# EAGLE design PumpkinHardwareV2 (EAGLE 9.6.2)
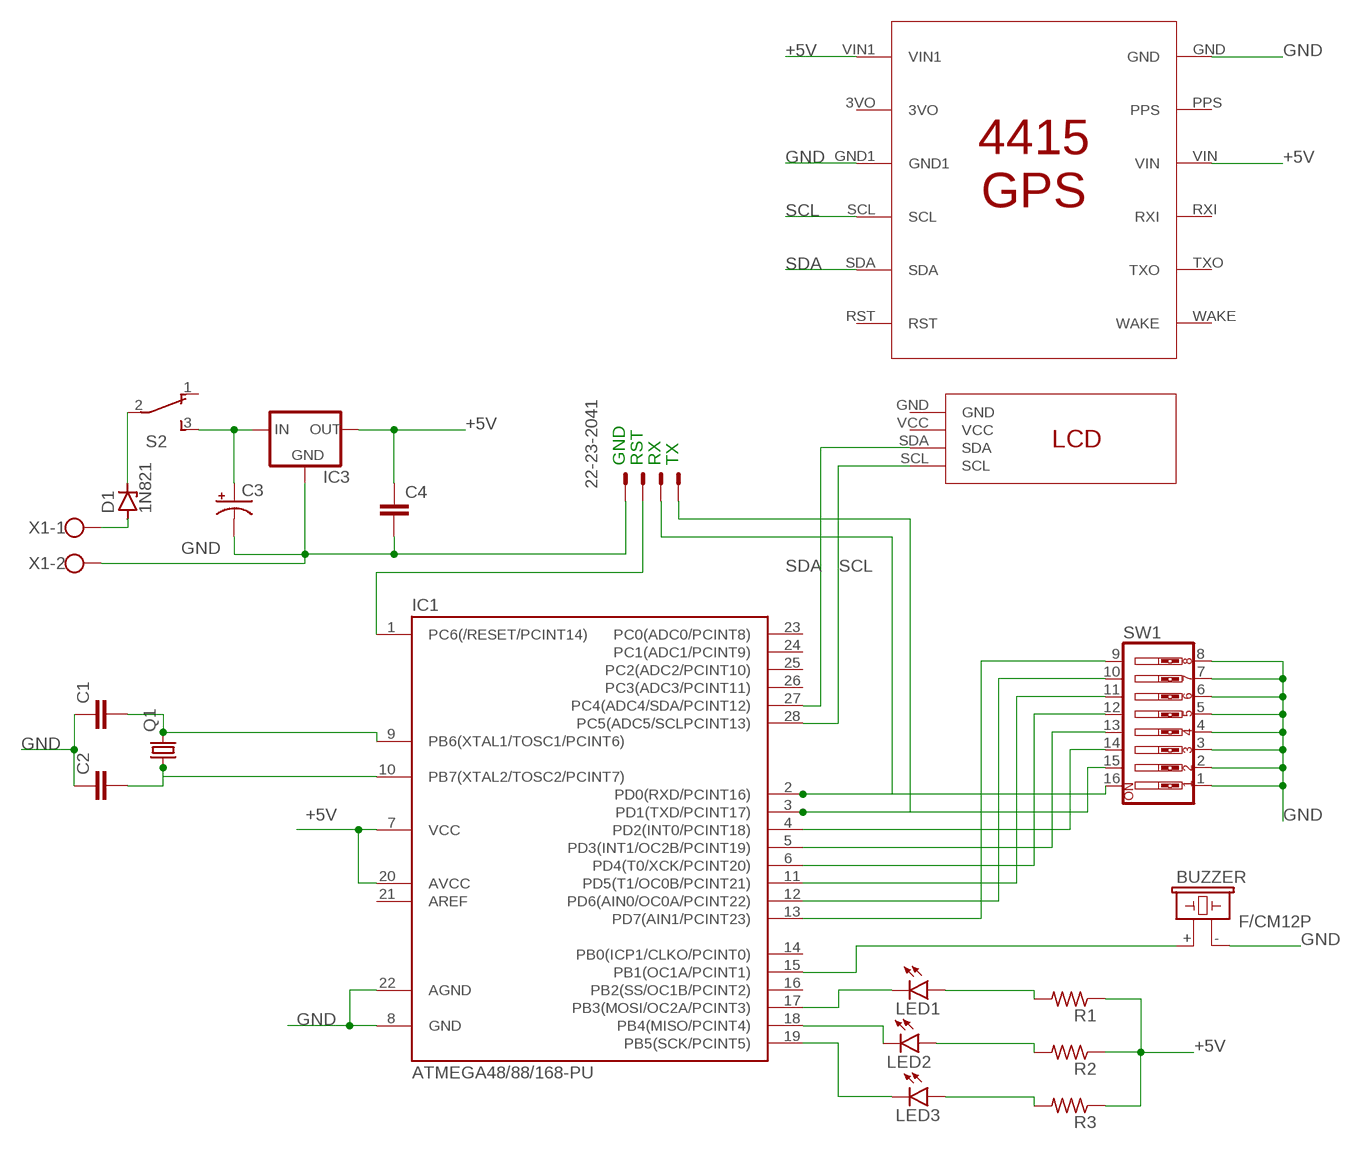
[diagram p0: schematic, sheet 1]

## Parts
BUZZER  F/CM12P  [F/CM12P]
C1  C2.5/2  [C2.5-2]
C2  C2.5/2  [C2.5-2]
C3  CPOL-USE3.5-8  [E3,5-8]
C4  C2.5/2  [C2.5-2]
D1  1N821  [DO35Z10]
GPS  4415  [4415]
IC1  ATMEGA48/88/168-PU  [DIL28-3]
IC3  78XXL  [78XXL]
LED1  TLLG4400  [LED3MM]
LED2  TLLY4400  [LED3MM]
LED3  TLLR4400  [LED3MM]
Q1  CRYSTALHC49S  [HC49/S]
R1  R-US_0207/10  [0207/10]
R2  R-US_0207/10  [0207/10]
R3  R-US_0207/10  [0207/10]
S2  TL36PO  [TL3XPO]
SW1  SW_DIP-8  [EDG-08]
U$1  I2C_LCD  [I2C_LCD]
X1  W237-102  [W237-102]
X2  22-23-2041  [22-23-2041]

## Nets
+5V: C4.1 GPS.VIN GPS.VIN1 IC1.7(VCC) IC1.20(AVCC) IC3.OUT R1.1 R2.1 R3.1
GND: BUZZER.- C1.1 C2.1 C3.- C4.2 GPS.GND GPS.GND1 IC1.8(GND) IC1.22(AGND) IC3.GND SW1.1 SW1.2 SW1.3 SW1.4 SW1.5 SW1.6 SW1.7 SW1.8 X1.2 X2.1
N$1: LED1.A R1.2
N$2: IC1.18(PB4(MISO/PCINT4)) LED2.K(C)
N$3: IC1.19(PB5(SCK/PCINT5)) LED3.K(C)
N$4: LED2.A R2.2
N$5: LED3.A R3.2
N$6: IC1.17(PB3(MOSI/OC2A/PCINT3)) LED1.K(C)
N$7: IC1.13(PD7(AIN1/PCINT23)) SW1.9
N$8: IC1.12(PD6(AIN0/OC0A/PCINT22)) SW1.10
N$9: IC1.11(PD5(T1/OC0B/PCINT21)) SW1.11
N$10: IC1.6(PD4(T0/XCK/PCINT20)) SW1.12
N$11: IC1.5(PD3(INT1/OC2B/PCINT19)) SW1.13
N$12: IC1.4(PD2(INT0/PCINT18)) SW1.14
N$13: IC1.3(PD1(TXD/PCINT17)) SW1.15 X2.4
N$14: D1.C S2.2(P)
N$15: C2.2 IC1.10(PB7(XTAL2/TOSC2/PCINT7)) Q1.1
N$16: C1.2 IC1.9(PB6(XTAL1/TOSC1/PCINT6)) Q1.2
N$17: D1.A X1.1
N$18: C3.+ IC3.IN S2.3(S)
N$19: BUZZER.+ IC1.15(PB1(OC1A/PCINT1))
N$20: IC1.1(PC6(/RESET/PCINT14)) X2.2
N$21: IC1.2(PD0(RXD/PCINT16)) SW1.16 X2.3
SCL: GPS.SCL IC1.28(PC5(ADC5/SCLPCINT13)) U$1.SCL
SDA: GPS.SDA IC1.27(PC4(ADC4/SDA/PCINT12)) U$1.SDA
Unconnected: GPS.3VO GPS.PPS GPS.RST GPS.RXI GPS.TXO GPS.WAKE IC1.14(PB0(ICP1/CLKO/PCINT0)) IC1.16(PB2(SS/OC1B/PCINT2)) IC1.21(AREF) IC1.23(PC0(ADC0/PCINT8)) IC1.24(PC1(ADC1/PCINT9)) IC1.25(PC2(ADC2/PCINT10)) IC1.26(PC3(ADC3/PCINT11)) S2.1(O) U$1.GND U$1.VCC

## Notes on the sheet
- GND | RST | RX | TX

## Library data of the parts
BUZZER = buzzer:F/CM12P: BUZZER Source: Buerklin; OC_FARNELL: unknown; OC_NEWARK: unknown
C1 C2 C4 = capacitor-wima:C: CAPACITOR naming: grid - package width
C3 = rcl:CPOL-US: POLARIZED CAPACITOR, American symbol; SPICEPREFIX: C
D1 = diode:1N821: Reference DIODE temperature compensated, 6,2 V
GPS = pumpkin_computer_lib:4415
IC1 = atmega8:ATMEGA48/88/168-PU
IC3 = v-reg:78XXL: VOLTAGE REGULATOR
LED1 = led:TLLG4400: Low Current (2mA) LED 3 mm Tinted Diffused Package color GREEN Source: Data sheet <http://www.farnell.com/datasheets/391098.pdf>; MF: VISHAY SEMICONDUCTOR; OC_FARNELL: 1612435
LED2 = led:TLLY4400: Low Current (2mA) LED 3 mm Tinted Diffused Package color YELLOW Source: Data sheet <http://www.farnell.com/datasheets/391098.pdf>; MF: VISHAY SEMICONDUCTOR; OC_FARNELL: 1612439
LED3 = led:TLLR4400: Low Current (2mA) LED 3 mm Tinted Diffused Package color RED Source: Data sheet <http://www.farnell.com/datasheets/391100.pdf>; MF: VISHAY SEMICONDUCTOR; OC_FARNELL: 1612437
Q1 = crystal:CRYSTAL: CRYSTAL; OC_FARNELL: 1667008; OC_NEWARK: unknown
R1-R3 = rcl:R-US_: RESISTOR, American symbol; SPICEPREFIX: R
S2 = switch:TL36PO: TINY SWITCH ON - ON Source: http://www2.produktinfo.conrad.com/datenblaetter/700000-724999/705152-da-01-de-Subminiaturschalter_TL_36YO.pdf
SW1 = special:SW_DIP-8: DIP SWITCH
U$1 = pumpkin_computer_lib:I2C_LCD
X1 = con-wago-500:W237-102: WAGO SCREW CLAMP; MPN: 237-102; OC_FARNELL: unknown; OC_NEWARK: 70K9898
X2 = con-molex:22-23-2041: .100" (2.54mm) Center Header - 4 Pin; MF: MOLEX; MPN: 22-23-2041; OC_FARNELL: 1462920; OC_NEWARK: 38C0355

## Board
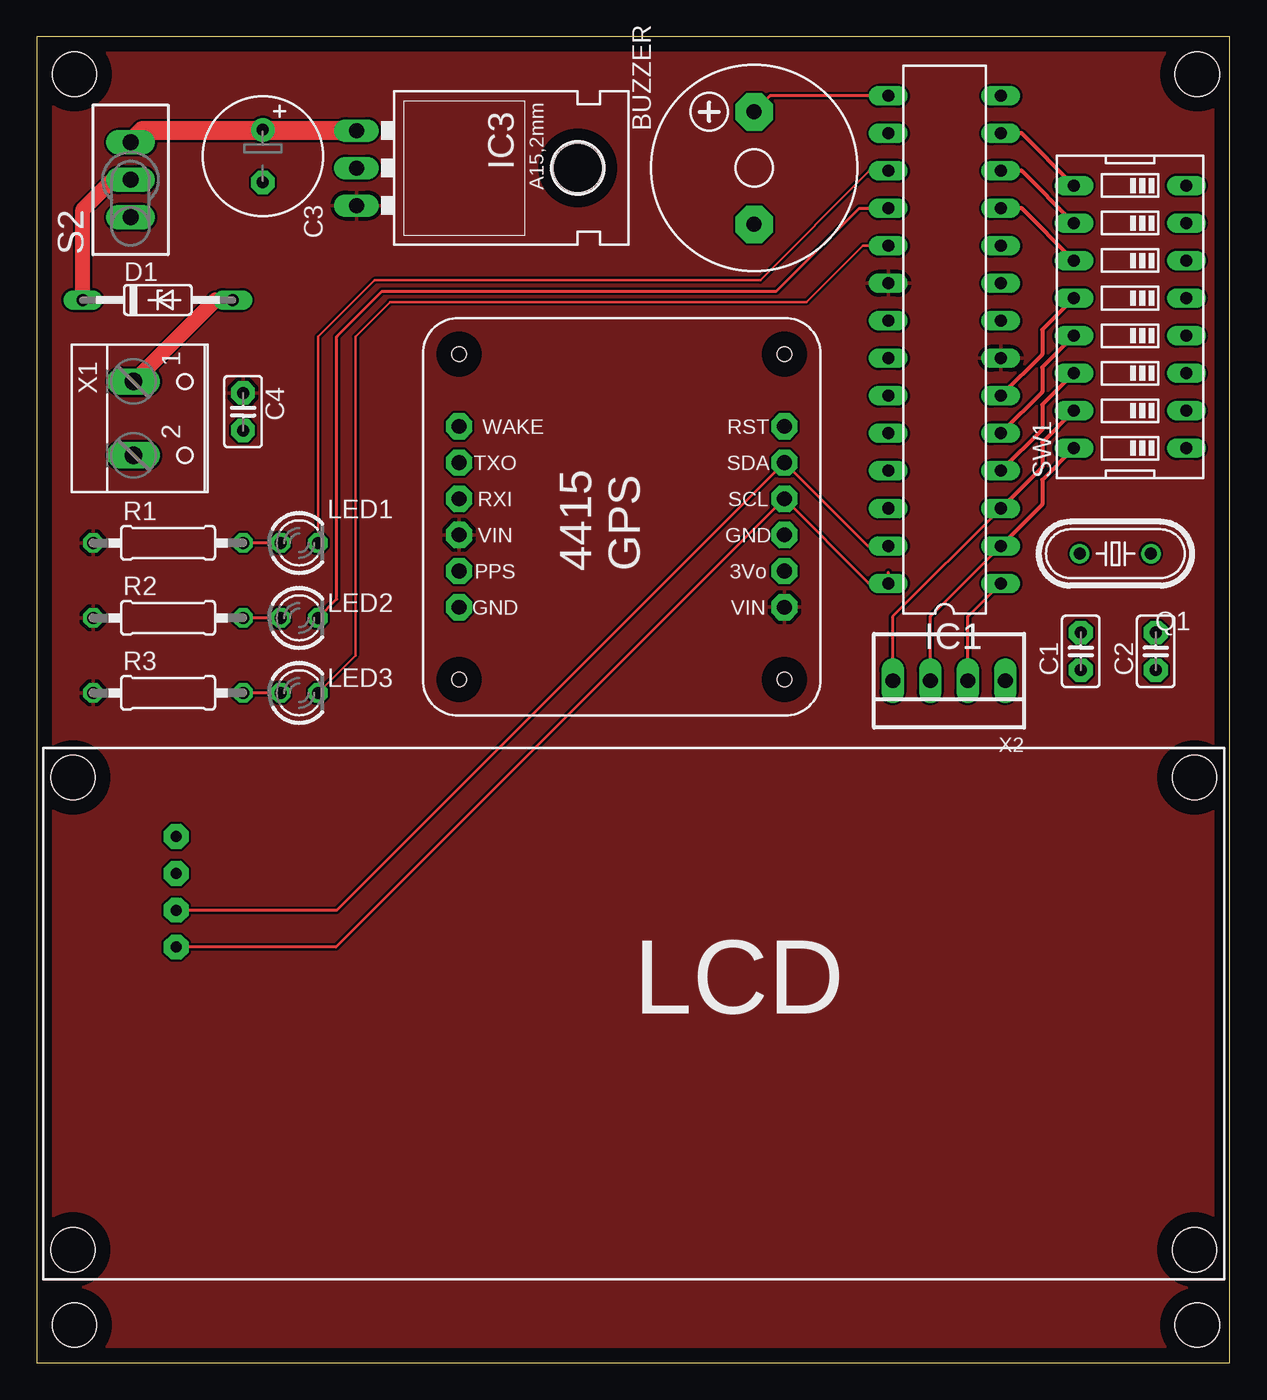
[diagram p1: board, top side]
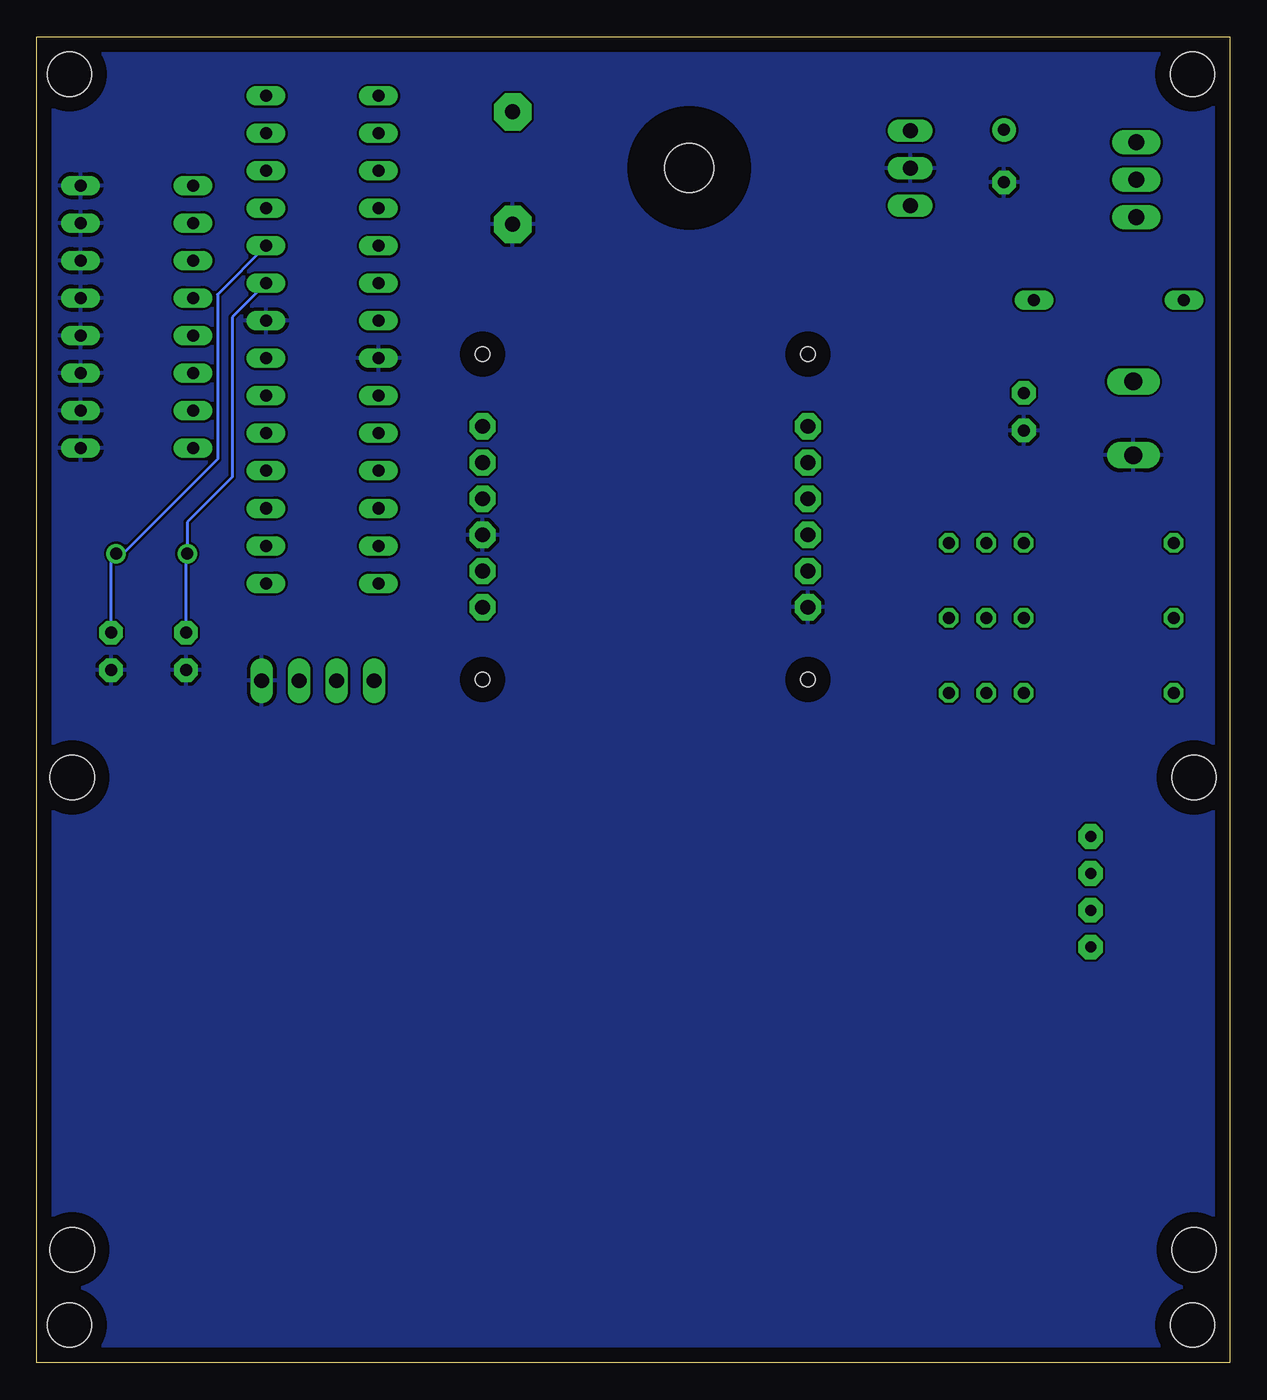
[diagram p2: board, bottom side, seen from below]

Size 80.84 x 89.82 mm. Coordinates in mm from the lower left corner, seen from the top.
Outline: 0,0 80.84,0 80.84,89.82 0,89.82 0,0
Copper layers (1*16): Top 0.035mm / dielectric 1.5mm / Bottom 0.035mm
Design rules "default": minimum track width 6mil, minimum drill 0.35mm, track to track 6mil, track to pad 6mil, pad to pad 6mil, via to via 6mil, smd to smd 6mil, copper to edge 40mil, drill to drill 6mil, minimum pad ring 10mil, minimum via ring 8mil, stop-mask expansion 4mil, vias tented up to drill 0mil, thermal gap 10mil
Holes 3 mm at 2.54,87.29 78.63,87.29 78.63,2.54 2.54,2.54

### Footprints (pad centres in the part's own frame; a part is rotated, then mirrored left to right if it is on the bottom)
F/CM12P = drill 1.016 pad 2.54 octagon: + 3.81,0; - -3.81,0
C2.5-2 = drill 0.813 pad 1.6 octagon: 1 -1.27,0; 2 1.27,0
E3,5-8 = drill 0.813 pad 1.6: + -1.778,0 | drill 0.813 pad 1.6 octagon: - 1.778,0
DO35Z10 = drill 0.813 long: A 5.08,0; C -5.08,0
4415 = drill 1 pad 1.778 octagon: 3VO -2.9,-10.25; GND -5.35,11.8; GND1 -0.45,-10.25; PPS -2.9,11.8; RST 6.9,-10.25; RXI 2,11.8; SCL 2,-10.25; SDA 4.45,-10.25; TXO 4.45,11.8; VIN -0.45,11.8; VIN1 -5.35,-10.25; WAKE 6.9,11.8 | hole 1: -10.25,11.8; 11.8,11.8; 11.8,-10.25; -10.25,-10.25
DIL28-3 = drill 0.813 long: 1 -16.51,-3.81; 2 -13.97,-3.81; 3 -11.43,-3.81; 4 -8.89,-3.81; 5 -6.35,-3.81; 6 -3.81,-3.81; 7 -1.27,-3.81; 8 1.27,-3.81; 9 3.81,-3.81; 10 6.35,-3.81; 11 8.89,-3.81; 12 11.43,-3.81; 13 13.97,-3.81; 14 16.51,-3.81; 15 16.51,3.81; 16 13.97,3.81; 17 11.43,3.81; 18 8.89,3.81; 19 6.35,3.81; 20 3.81,3.81; 21 1.27,3.81; 22 -1.27,3.81; 23 -3.81,3.81; 24 -6.35,3.81; 25 -8.89,3.81; 26 -11.43,3.81; 27 -13.97,3.81; 28 -16.51,3.81
78XXL = drill 1.016 long: GND 0,-3.81; IN -2.54,-3.81; OUT 2.54,-3.81 | hole 3.302: 0,11.176
LED3MM = drill 0.813 octagon: A -1.27,0; K 1.27,0
HC49/S = drill 0.813: 1 -2.413,0; 2 2.413,0
0207/10 = drill 0.813 octagon: 1 -5.08,0; 2 5.08,0
TL3XPO = drill 1.1 pad 1.422 long: 1 -2.54,0; 2 0,0; 3 2.54,0
EDG-08 = drill 0.813 long: 1 -8.89,-3.81; 2 -6.35,-3.81; 3 -3.81,-3.81; 4 -1.27,-3.81; 5 1.27,-3.81; 6 3.81,-3.81; 7 6.35,-3.81; 8 8.89,-3.81; 9 8.89,3.81; 10 6.35,3.81; 11 3.81,3.81; 12 1.27,3.81; 13 -1.27,3.81; 14 -3.81,3.81; 15 -6.35,3.81; 16 -8.89,3.81
I2C_LCD = drill 0.75 pad 1.676 octagon: GND -31,12; SCL -31,4.5; SDA -31,7; VCC -31,9.5 | hole 3: -38,16; -38,-16; 38,-16; 38,16
W237-102 = drill 1.194 long: 1 -2.5,-1.27; 2 2.5,-1.27
22-23-2041 = drill 1 long: 1 -3.81,0; 2 -1.27,0; 3 1.27,0; 4 3.81,0

### Placement (x,y rotation side)
BUZZER  48.6,80.94 90 top
C1  70.73,48.19 90 top
C2  75.81,48.19 90 top
C3  15.31,81.74 270 top
C4  13.97,64.43 270 top
D1  8.2,72 0 top
GPS  40.4,56.53 90 top
IC1  61.5,69.31 90 top
IC3  25.47,80.94 270 top
LED1  17.78,55.54 0 top
LED2  17.78,50.46 0 top
LED3  17.78,45.38 0 top
Q1  73.07,54.81 180 top
R1  8.89,55.54 0 top
R2  8.89,50.46 0 top
R3  8.89,45.38 0 top
S2  6.35,80.14 90 top
SW1  74.07,70.85 90 top
U$1  40.44,23.65 0 top
X1  7.82,63.97 270 top
X2  61.8,46.2 180 top

### Tracks (layer width: path | path; a pad name or v marks a point on that pad's centre or on a via)
+5V
  pour Top: -3.81,96.18 93.98,96.18 93.98,-3.81 -3.81,-3.81
GND
  pour Bottom: -2.54,94.91 95.25,94.91 95.25,-5.08 -2.54,-5.08
N$1
  Top 0.2: LED1.A R1.2
N$2
  Top 0.2: LED2.K 20.32,51.73 20.32,69.51 23.39,72.58 50.1,72.58 55.72,78.2 IC1.18
N$3
  Top 0.152: IC1.19 55.95,75.66 52.14,71.85 23.93,71.85 21.59,69.51 21.59,47.92 LED3.K
N$4
  Top 0.2: LED2.A R2.2
N$5
  Top 0.2: LED3.A R3.2
N$6
  Top 0.152: LED1.K 19.05,69.51 22.87,73.33 49.01,73.33 56.42,80.74 IC1.17
N$7
  Top 0.254: SW1.9 66.72,83.28 IC1.13
N$8
  Top 0.254: SW1.10 66.72,80.74 IC1.12
N$9
  Top 0.254: SW1.11 66.72,78.2 IC1.11
N$10
  Top 0.254: SW1.12 68.11,69.97 68.11,68.3 IC1.6
N$11
  Top 0.254: SW1.13 68.11,67.43 68.11,65.76 IC1.5
N$12
  Top 0.254: SW1.14 68.11,64.89 68.11,63.22 IC1.4
N$13
  Top 0.2: IC1.3 57.98,50.55 57.98,46.21 X2.4
  Top 0.254: SW1.15 68.11,62.35 68.11,60.68 IC1.3
N$14
  Top 1.016: D1.C 3.12,78.12 5.2,80.2 6.29,80.2 S2.2
N$15
  Bottom 0.2: IC1.10 68.6,72.37 68.6,61.2 74.99,54.81 Q1.1 75.81,54.48 C2.2
N$16
  Bottom 0.2: 70.66,55 70.66,56.94 67.6,60 67.6,70.83 IC1.9 | 70.66,55 Q1.2 | C1.2 70.73,54.93 70.66,55
N$17
  Top 1.016: X1.1 12.08,72 D1.A
N$18
  Top 1.27: S2.3 7.15,83.48 15.27,83.48 C3.+ 15.35,83.48 IC3.IN
N$19
  Top 0.2: IC1.15 49.67,85.82 BUZZER.+
N$20
  Top 0.2: X2.2 63.07,50.56 IC1.1
N$21
  Top 0.2: X2.3 60.53,50.56 IC1.2
  Top 0.254: SW1.16 68.11,59.81 68.11,58.14 IC1.2
SCL
  Top 0.152: U$1.SCL 18.66,28.15
  Top 0.2: 57.69,53.55 IC1.28 56.38,52.8 GPS.SCL 20.27,28.15 U$1.SCL
SDA
  Top 0.152: U$1.SDA 17.39,30.65
  Top 0.2: IC1.27 56.29,55.34 GPS.SDA 20.32,30.65 U$1.SDA